# EAGLE design prototype_total_schematic_2355 (EAGLE 8.4.1)
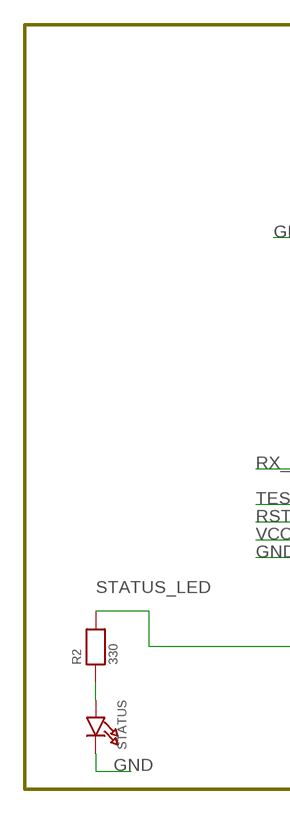
[diagram p0: schematic, sheet 1, part 1 of 2]
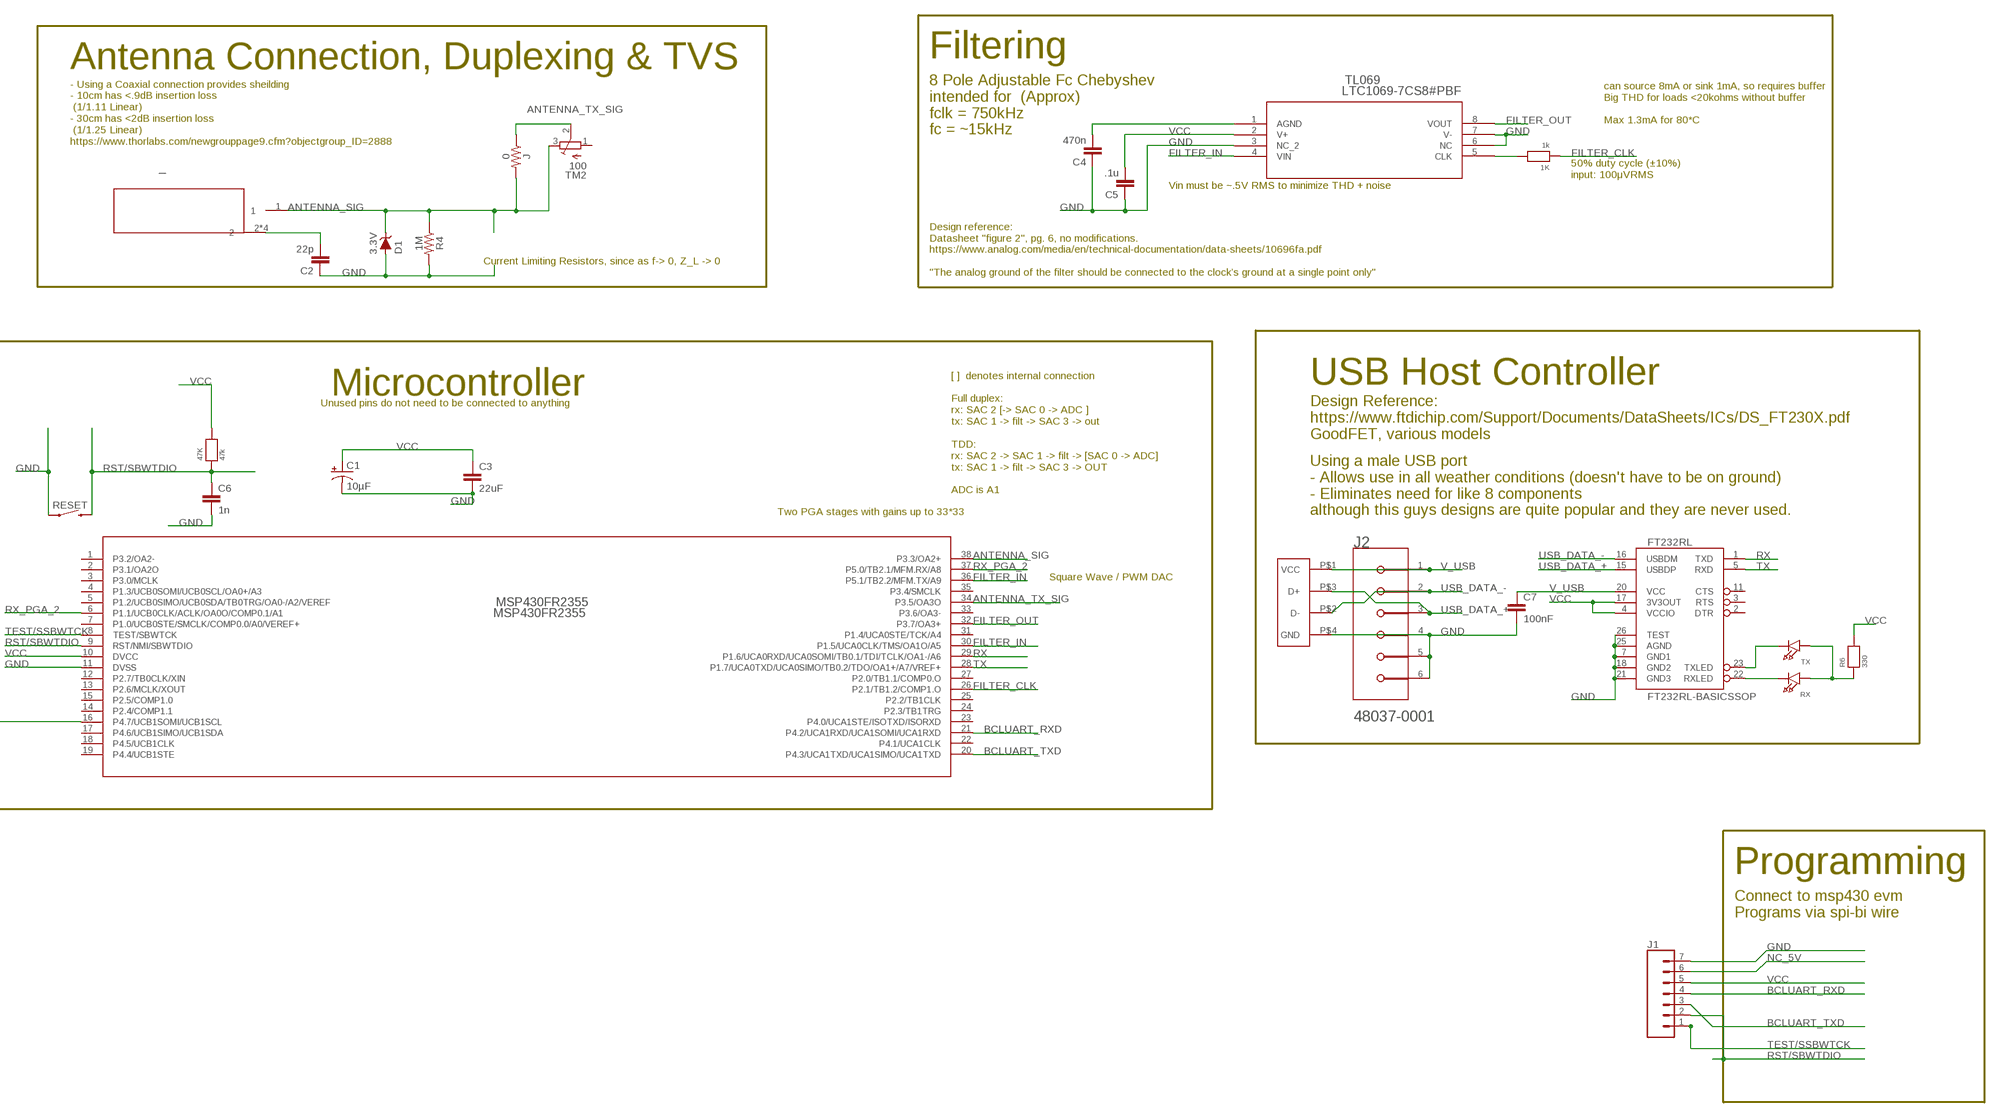
[diagram p1: schematic, sheet 1, part 2 of 2]

## Parts
1K  1k  RESISTOR0805  [0805]
47K  47k  RESISTOR0805  [0805]
_  5-1814400-1  [5-1814400-1]
C1  10µF  10UF-POLAR-EIA6032-25V-10%  [EIA6032-NOM]
C2  22p  22UF-0805-6.3V-20%  [0805]
C3  22uF  22UF-0805-6.3V-20%  [0805]
C4  470n  22UF-0805-6.3V-20%  [0805]
C5  .1u  22UF-0805-6.3V-20%  [0805]
C6  1n  22UF-0805-6.3V-20%  [0805]
C7  100nF  22UF-0805-6.3V-20%  [0805]
D1  3.3V  DIODE-ZENER-MM3Z3V3T1G  [SOD-323]
FT232RL  FT232RL-BASICSSOP  [SSOP28DB]
J  0  2.0KOHM-0603-1/10W-5%  [0603]
J1  CONN_07NO_SILK  [1X07_NO_SILK]
J2  MOLEX_48037-0001MOLEX_48037-0001_0_0  [MOLEX_48037-0001_0]
MSP430FR2355  MSP430FR2355  [DA38]
R2  330  RESISTOR0805  [0805]
R4  1M  2.0KOHM-0603-1/10W-5%  [0603]
R6  330  RESISTOR0805  [0805]
RESET  MOMENTARY-SWITCH-SPST-PTH-6.0MM  [TACTILE_SWITCH_PTH_6.0MM]
RX  LED0805  [CHIPLED_0805]
STATUS  LED0805  [CHIPLED_0805]
TL069  LTC1069-7CS8#PBF  [SO-8_S]
TM2  100  TRIMPOTTC33X  [TC33X]
TX  LED0805  [CHIPLED_0805]
U$1  USB-PCB  [PCB_USB]

## Nets
ANTENNA_SIG: _.1 D1.C J.2 MSP430FR2355.38(P3.3/OA2+) R4.1 TM2.3(E)
ANTENNA_TX_SIG: J.1 MSP430FR2355.34(P3.5/OA3O) TM2.2(S)
BCLUART_RXD: J1.4 MSP430FR2355.21(P4.2/UCA1RXD/UCA1SOMI/UCA1RXD)
BCLUART_TXD: J1.3 MSP430FR2355.20(P4.3/UCA1TXD/UCA1SIMO/UCA1TXD)
FILTER_CLK: 1K.1 MSP430FR2355.26(P2.1/TB1.2/COMP1.O)
FILTER_IN: MSP430FR2355.30(P1.5/UCA0CLK/TMS/OA1O/A5) MSP430FR2355.36(P5.1/TB2.2/MFM.TX/A9) TL069.4(VIN)
FILTER_OUT: MSP430FR2355.32(P3.7/OA3+) TL069.8(VOUT)
GND: C1.C(-) C2.1 C3.2 C4.1 C5.1 C6.2 C7.2 D1.A FT232RL.7(GND1) FT232RL.18(GND2) FT232RL.21(GND3) FT232RL.25(AGND) FT232RL.26(TEST) J1.7 J2.4 J2.5(MNT_1) J2.6(MNT_2) MSP430FR2355.11(DVSS) R4.2 RESET.1 STATUS.C TL069.3(NC_2) TL069.6(NC) TL069.7(V-) U$1.P$4(GND)
N$1: 1K.2 TL069.5(CLK)
N$2: _.2 _.3 _.4 _.5 C2.2
N$3: C4.2 TL069.1(AGND)
N$19: R2.1 STATUS.A
N$20: FT232RL.22(RXLED) RX.C
N$21: FT232RL.23(TXLED) TX.C
N$22: R6.1 RX.A TX.A
NC_5V: J1.6
RST/SBWTDIO: 47K.1 C6.1 J1.2 MSP430FR2355.9(RST/NMI/SBWTDIO) RESET.3
RX: FT232RL.1(TXD) MSP430FR2355.29(P1.6/UCA0RXD/UCA0SOMI/TB0.1/TDI/TCLK/OA1-/A6)
RX_PGA_2: MSP430FR2355.6(P1.1/UCB0CLK/ACLK/OA0O/COMP0.1/A1) MSP430FR2355.37(P5.0/TB2.1/MFM.RX/A8)
STATUS_LED: MSP430FR2355.16(P4.7/UCB1SOMI/UCB1SCL) R2.2
TEST/SSBWTCK: J1.1 MSP430FR2355.8(TEST/SBWTCK)
TX: FT232RL.5(RXD) MSP430FR2355.28(P1.7/UCA0TXD/UCA0SIMO/TB0.2/TDO/OA1+/A7/VREF+)
USB_DATA_+: FT232RL.15(USBDP) J2.3 U$1.P$3(D+)
USB_DATA_-: FT232RL.16(USBDM) J2.2 U$1.P$2(D-)
V_USB: C7.1 FT232RL.20(VCC) J2.1 U$1.P$1(VCC)
VCC: 47K.2 C1.A(+) C3.1 C5.2 FT232RL.4(VCCIO) FT232RL.17(3V3OUT) J1.5 MSP430FR2355.10(DVCC) R6.2 TL069.2(V+)
Unconnected: FT232RL.2(DTR) FT232RL.3(RTS) FT232RL.11(CTS) MSP430FR2355.1(P3.2/OA2-) MSP430FR2355.2(P3.1/OA2O) MSP430FR2355.5(P1.2/UCB0SIMO/UCB0SDA/TB0TRG/OA0-/A2/VEREF) MSP430FR2355.7(P1.0/UCB0STE/SMCLK/COMP0.0/A0/VEREF+) MSP430FR2355.12(P2.7/TB0CLK/XIN) MSP430FR2355.13(P2.6/MCLK/XOUT) MSP430FR2355.14(P2.4/COMP1.1) MSP430FR2355.15(P2.5/COMP1.0) MSP430FR2355.17(P4.6/UCB1SIMO/UCB1SDA) MSP430FR2355.18(P4.5/UCB1CLK) MSP430FR2355.19(P4.4/UCB1STE) MSP430FR2355.22(P4.1/UCA1CLK) MSP430FR2355.23(P4.0/UCA1STE/ISOTXD/ISORXD) MSP430FR2355.24(P2.3/TB1TRG) MSP430FR2355.25(P2.2/TB1CLK) MSP430FR2355.27(P2.0/TB1.1/COMP0.O) MSP430FR2355.31(P1.4/UCA0STE/TCK/A4) MSP430FR2355.35(P3.4/SMCLK) TM2.1(A)

## Notes on the sheet
- Antenna Connection, Duplexing & TVS | Filtering
- can source 8mA or sink 1mA, so requires buffer
  Big THD for loads <20kohms without buffer
  
  Max 1.3mA for 80*C
- 8 Pole Adjustable Fc Chebyshev
  intended for  (Approx)
  fclk = 750kHz 
  fc = ~15kHz
- - Using a Coaxial connection provides sheilding
  - 10cm has <.9dB insertion loss
   (1/1.11 Linear)
  - 30cm has <2dB insertion loss
   (1/1.25 Linear)
  https://www.thorlabs.com/newgrouppage9.cfm?objectgroup_ID=2888
- 50% duty cycle (±10%)
  input: 100μVRMS
- Vin must be ~.5V RMS to minimize THD + noise
- Current Limiting Resistors, since as f-> 0, Z_L -> 0
- Design reference: 
  Datasheet "figure 2", pg. 6, no modifications.
  https://www.analog.com/media/en/technical-documentation/data-sheets/10696fa.pdf
  
  "The analog ground of the filter should be connected to the clock’s ground at a single point only"
- Microcontroller | USB Host Controller
- Unused pins do not need to be connected to anything
- Design Reference:
  https://www.ftdichip.com/Support/Documents/DataSheets/ICs/DS_FT230X.pdf
  GoodFET, various models
- [ ]  denotes internal connection
  
  Full duplex:
  rx: SAC 2 [-> SAC 0 -> ADC ]
  tx: SAC 1 -> filt -> SAC 3 -> out
  
  TDD:
  rx: SAC 2 -> SAC 1 -> filt -> [SAC 0 -> ADC]
  tx: SAC 1 -> filt -> SAC 3 -> OUT 
  
  ADC is A1
- Two PGA stages with gains up to 33*33
- Using a male USB port
  - Allows use in all weather conditions (doesn't have to be on ground)
  - Eliminates need for like 8 components 
  although this guys designs are quite popular and they are never used.
- Square Wave / PWM DAC
- Programming
- Connect to msp430 evm
  Programs via spi-bi wire

## Power pins joined to a net without a drawn wire
P1.3/UCB0SOMI/UCB0SCL/OA0+/A3: MSP430FR2355.4(P1.3/UCB0SOMI/UCB0SCL/OA0+/A3)
P3.0/MCLK: MSP430FR2355.3(P3.0/MCLK)
P3.6/OA3-: MSP430FR2355.33(P3.6/OA3-)

## Library data of the parts
1K 47K R2 R6 = microbuilder:RESISTOR: Resistors 0402 - 0402 Surface Mount Package 22 Ohm 1% 1/16W [Digikey: 311-22.0LRTR-ND] 33 Ohm 5% 1/16W 1.0K 5% 1/16W 1.5K 5% 1/16W 2.0K 1% 1/16W 10.0K 1% 1/16W [Digikey: 311-10.0KLRTR-ND] 10.0K 5% 1/16W [Digikey: RMCF0402JT10K0TR-ND] 12.1K 1% 1/16W [Digikey: 311-22.0LRTR-ND] 100.0K 5% 1/16W 0603 - 0603 Surface Mount Package 0 Ohm 1/10 Watt 1% Resistor 15 Ohm 1/10 Watt 1% Resistor 33 Ohm 1/10 Watt 1% Resistor 49.9 Ohm 1/10 Watt 1% Resistor 100 Ohm 1/10 Watt 1% Resistor 150 Ohm 1/10 Watt 1% Resistor 240 Ohm 1/10 Watt 1% Resistor 390 Ohm 1/10 Watt 1% Resistor 560 Ohm 1/10 Watt 1% Resistor 680 Ohm 1/10 Watt 1% Resistor 750 Ohm 1/10 Watt 1% Resistor 1.0K Ohm 1/10 Watt 1% Resistor 1.5K Ohm 1/10 Watt 1% Resistor 2.0K Ohm 1/10 Watt 1% Resistor 2.2K Ohm 1/10 Watt 1% Resistor 3.3K Ohm 1/10 Watt 1% Resistor 4.7K Ohm 1/10 Watt 1% Resistor 10.0K Ohm 1/10 Watt 1% Resistor 12.0K Ohm 1/10 Watt 1% Resistor 12.1K Ohm 1/10 Watt 1% Resistor 20.0K Ohm 1/10 Watt 1% Resistor 33.0K Ohm 1/10 Watt 1% Resistor 100.0K Ohm 1/10 Watt 1% Resistor 0805 - 0805 Surface Mount Package 0 Ohm 1/8 Watt 1% Resistor 33 Ohm 1/8 Watt 1% Resistor 100 Ohm 1/8 Watt 1% Resistor 150 Ohm 1/8 Watt 1% Resistor 200 Ohm 1/8 Watt 1% Resistor 240 Ohm 1/8 Watt 1% Resistor 330 Ohm 1/8 Watt 1% Resistor 390 Ohm 1/8 Watt 1% Resistor 470 Ohm 1/8 Watt 1% Resistor 1.0K Ohm 1/8 Watt 1% Resistor 1.5K Ohm 1/8 Watt 1% Resistor 2.0K Ohm 1/8 Watt 1% Resistor 4.7K Ohm 1/8 Watt 1% Resistor 5.1K Ohm 1/8 Watt 1% Resistor 5.6K Ohm 1/8 Watt 1% Resistor 10.0K Ohm 1/8 Watt 1% Resistor 22.0K Ohm 1/8 Watt 1% Resistor 33.0K Ohm 1/8 Watt 1% Resistor 100K Ohm 1/8 Watt 1% Resistor 1206 - 1206 Surface Mount Package 2012 - 2010 Surface Mount Package 0.11 Ohm 1/2 Watt 1% Resistor - Digikey: RHM.11UCT-ND
_ = TTE:5-1814400-1; MANUFACTURER_PART_NUMBER: 518144001; VENDOR: TE Connectivity
C1 = SparkFun-Capacitors:10UF-POLAR: 10.0µF polarized capacitors A capacitor is a passive two-terminal electrical component used to store electrical energy temporarily in an electric field.; PROD_ID: CAP-12984
C2 C4-C7 = SparkFun-Capacitors:22UF: 22µF ceramic capacitors A capacitor is a passive two-terminal electrical component used to store electrical energy temporarily in an electric field.; PROD_ID: CAP-08402; VALUE: 22uF
C3 = SparkFun-Capacitors:22UF: 22µF ceramic capacitors A capacitor is a passive two-terminal electrical component used to store electrical energy temporarily in an electric field.; PROD_ID: CAP-08402
D1 = SparkFun-DiscreteSemi:DIODE-ZENER: Zener Diode A Zener diode allows current to flow from its anode to its cathode like a normal semiconductor diode, but it also permits current to flow in the reverse direction when its "Zener voltage" is reached. - WIkipedia; PROD_ID: DIO-11284
FT232RL = SparkFun:FT232RL-BASIC: USB UART This is the simplified version of the FT232RL unit. Only what you need, nothing you don't. Spark Fun Electronics SKU : COM-00650
J R4 = SparkFun-Resistors:2.0KOHM: 2kΩ resistor A resistor is a passive two-terminal electrical component that implements electrical resistance as a circuit element. Resistors act to reduce current flow, and, at the same time, act to lower voltage levels within circuits. - Wikipedia; PROD_ID: RES-08296; VALUE: 2.0k
J1 = SparkFun-Connectors:CONN_07: Multi connection point. Often used as Generic Header-pin footprint for 0.1 inch spaced/style header connections On any of the 0.1 inch spaced packages, you can populate with these: Break Away Headers - Straight <https://www.sparkfun.com/products/116> (PRT-00116) Break Away Male Headers - Right Angle <https://www.sparkfun.com/products/553> (PRT-00553) Female Headers <https://www.sparkfun.com/products/115> (PRT-00115) Break Away Headers - Machine Pin <https://www.sparkfun.com/products/117> (PRT-00117) Break Away Female Headers - Swiss Machine Pin <https://www.sparkfun.com/products/743> (PRT-00743) For SCREWTERMINALS and SPRING TERMINALS visit here: Screw Terimnals on SparkFun.com <https://www.sparkfun.com/search/results?term=Screw+Terminals> (5mm/3.5mm/2.54mm spacing) This device is also useful as a general connection point to wire up your design to another part of your project. Our various solder wires solder well into these plated through hole pads. Hook-Up Wire - Assortment (Stranded, 22 AWG) <https://www.sparkfun.com/products/11375> (PRT-11375) Hook-Up Wire - Assortment (Solid Core, 22 AWG) <https://www.sparkfun.com/products/11367> (PRT-11367) View the entire wire category on our website here <https://www.sparkfun.com/categories/141> Special notes: Molex polarized connector foot print use with SKU : PRT-08231 with associated crimp pins and housings. 1MM SMD Version SKU: PRT-10208 NOTES ON THE VARIANTS LOCK and LOCK_LONGPADS... This footprint was designed to help hold the alignment of a through-hole component (i.e. 6-pin header) while soldering it into place. You may notice that each hole has been shifted either up or down by 0.005 of an inch from it's more standard position (which is a perfectly straight line). This slight alteration caused the pins (the squares in the middle) to touch the edges of the holes. Because they are alternating, it causes a "brace" to hold the component in place. 0.005 has proven to be the perfect amount of "off-center" position when using our standard breakaway headers. Although looks a little odd when you look at the bare footprint, once you have a header in there, the alteration is very hard to notice. Also,if you push a header all the way into place, it is covered up entirely on the bottom side.
J2 = TTE:MOLEX_48037-0001: Universal Serial Bus (USB) Shielded I/O Plug, Type A, Right Angle, Through Hole, 0.76µm Gold (Au) Plating, PCB Thickness 1.20mm-1.60mm, Lead-Free; CENTROID_NOT_SPECIFIED: No; DATASHEET: http://www.molex.com/elqNow/elqRedir.htm?ref=http://www.molex.com/pdm_docs/sd/480370001_sd.pdf; DIGIKEY_DESCRIPTION: CONN PLUG USB 4POS RT ANG PCB; DIGIKEY_PART_NUMBER: WM17117-ND; IMPORTED_FROM: octopart; IS_FEMALE: yes; LEAD_FREE: yes; MF: Molex; MOUSER_PART_NUMBER: 538-48037-0001; MPN: 48037-0001; NUM_PINS: 2; OCTOPART_PART_NUMBER: 6671af1c981eb9b6; PACKAGE: CONN_USB_PTH_18MM8_12MM0; PREFIX: J; ROHS: yes; TEMPERATURE_RANGE_HIGH: +85°C; TEMPERATURE_RANGE_LOW: -20°C
MSP430FR2355 = TTE:MSP430FR2355
RESET = SparkFun-Switches:MOMENTARY-SWITCH-SPST: Momentary Switch (Pushbutton) - SPST Normally-open (NO) SPST momentary switches (buttons, pushbuttons). Variants PTH-12MM - 12mm square, through-hole Momentary Pushbutton Switch - 12mm Square <https://www.sparkfun.com/products/9190> (COM-09190) PTH-6.0MM, PTH-6.0MM-KIT - 6.0mm square, through-hole Mini Pushbutton Switch <https://www.sparkfun.com/products/97> (COM-00097) KIT package intended for soldering kit's - only one side of pads' copper is exposed. PTH-RIGHT-ANGLE-KIT - Right-angle, through-hole Right Angle Tactile Button <https://www.sparkfun.com/products/10791> - Used on SparkFun BigTime Watch Kit <https://www.sparkfun.com/products/11734> SMD-12MM - 12mm square, surface-mount Tactile Button - SMD (12mm) <https://www.sparkfun.com/products/12993> (COM-12993) Used on SparkFun PicoBoard <https://www.sparkfun.com/products/11888> SMD-4.5MM - 4.5mm Square Trackball Switch Used on SparkFun Blackberry Trackballer Breakout <https://www.sparkfun.com/products/13169> SMD-4.6MMX2.8MM - 4.60mm x 2.80mm, surface mount Used on SparkFun SAMD21 Mini Breakout <https://www.sparkfun.com/products/13664> SMD-5.2MM, SMD-5.2-REDUNDANT - 5.2mm square, surface-mount Mini Pushbutton Switch - SMD <https://www.sparkfun.com/products/8720> (COM-08720) Used on Arduino Pro Mini <https://www.sparkfun.com/products/11114> REDUNDANT package connects both switch circuits together SMD-6.0X3.5MM - 6.0 x 3.5mm, surface mount Momentary Reset Switch SMD <https://www.sparkfun.com/products/8229> (COM-08229) SMD-6.2MM-TALL - 6.2mm square, surface mount Tactile Button - SMD (6mm) <https://www.sparkfun.com/products/12992> Used on SparkFun Digital Sandbox <https://www.sparkfun.com/products/12651> SMD-RIGHT-ANGLE - Right-angle, surface mount Used on SparkFun Block for Intel® Edison - Arduino <https://www.sparkfun.com/products/13036>; PROD_ID: SWCH-08441; SF_SKU: COM-00097
RX STATUS TX = microbuilder:LED: LED 0603 - 0603 Surface Mount Package 2mA: Green LED - Low Power (3.9mcd, 2ma, 1.7Vf) - Digikey: 475-2709-2-ND Orange LED - Low Power (9.8mcd, 2ma, 1.8Vf) - Digikey: 475-1194-2-ND Red LED - Low Power (5mcd, 2ma, 1.8Vf) - Digikey: 475-1195-2-ND Yellow LED - Low Power (7mcd, 2ma, 1.8Vf) - Digikey: 475-1196-2-ND 5mA: Blue LED - Low Power (17mcd, 5ma, 2.9Vf) - Digikey: LNJ937W8CRACT-ND 0805 - 0805 Surface Mount Package 2mA: Red LED (8.8mcd, 2mA, 1.8Vf, Clear) - Low Power [Digikey: 475-2510-1-ND] Green LED (5mcd, 2mA, 1.8Vf, Clear) - Low Power [Digikey: 475-2730-1-ND] Yellow LED (11.3mcd, 2mA, 1.8Vf, Clear) - Low Power [Digikey: 475-2555-1-ND] 20mA: Red LED (104mcd, 20mA, Diffused) - LS R976 [Digikey: 475-1278-6-ND] Red LED (12mcd, 20mA, 2.0Vf, Clear) - APT2012EC [Digikey: 754-1128-1-ND] Green LED (15mcd, 20mA, 2.2Vf, Clear) - APT2012GC [Digikey: 754-1131-1-ND] Orange LED (160mcd, 20mA, 2.1Vf, Clear) - APT2012SECK [Digikey: 754-1130-1-ND] 1206 - 1206 Surface Mount Package Green LED (26mcd, 20mA, Diffused) - LG N971 [Digikey: 475-1407-6-ND] Red LED (15mcd, 20mA, Diffused) - LH N974 [Digikey: 475-1416-6-ND]
TL069 = TTE:LTC1069-7CS8#PBF; DESCRIPTION: LTC1069-7 - Linear Phase 8th Order Lowpass Filter; DIGI-KEY_PART_NUMBER: LTC1069-7CS8#PBF-ND; DIGI-KEY_PURCHASE_URL: https://www.digikey.com/product-detail/en/linear-technology-analog-devices/LTC1069-7CS8-PBF/LTC1069-7CS8-PBF-ND/889060?utm_source=snapeda&utm_medium=aggregator&utm_campaign=symbol; MF: Linear Technology; MP: LTC1069-7CS8#PBF; PACKAGE: SOIC-8 Linear Technology
TM2 = adafruit:TRIMPOT: SMT trimmer potentiometer part number TC33X http://www.ladyada.net/library/eagle
U$1 = TTE:USB-PCB

## Board
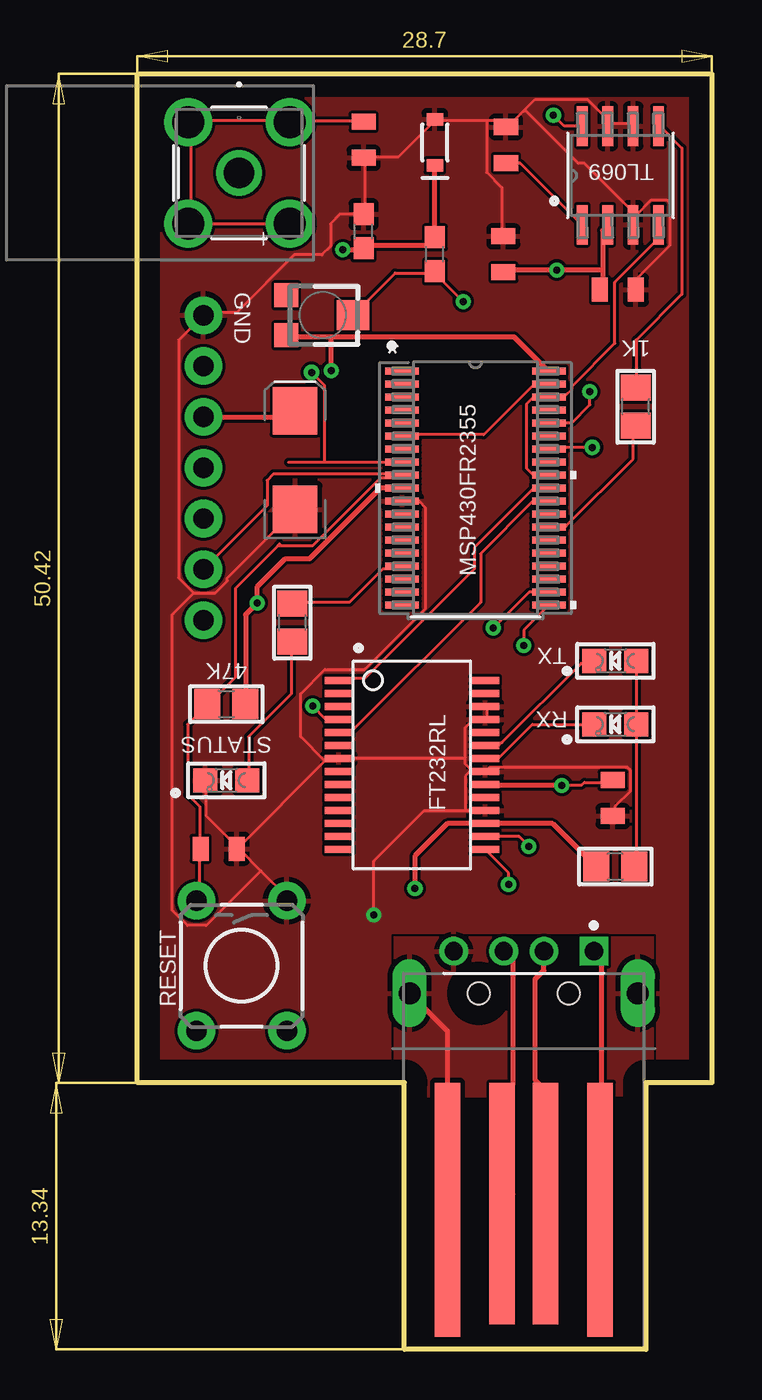
[diagram p2: board, top side]
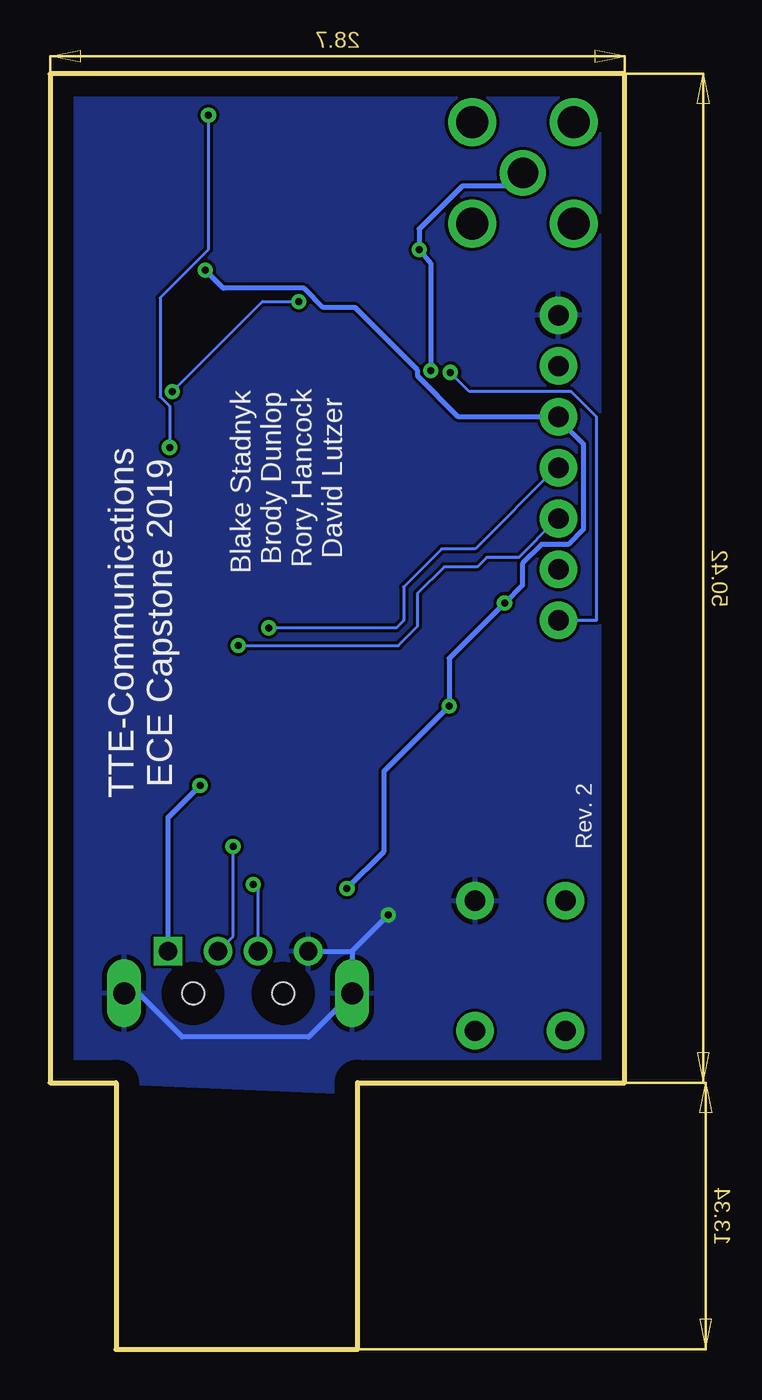
[diagram p3: board, bottom side, seen from below]

Size 28.7 x 63.75 mm. Coordinates in mm from the lower left corner, seen from the top.
Outline: 0,63.75 28.7,63.75 28.7,13.34 25.4,13.34 25.4,0 13.34,0 13.34,13.34 0,13.34 0,63.75
Copper layers (1*16): Top 0.035mm / dielectric 1.5mm / Bottom 0.035mm
Design rules "default": minimum track width 6mil, minimum drill 0.35mm, track to track 6mil, track to pad 6mil, pad to pad 6mil, via to via 6mil, smd to smd 6mil, copper to edge 40mil, drill to drill 6mil, minimum pad ring 10mil, minimum via ring 8mil, stop-mask expansion 4mil, vias tented up to drill 0mil, thermal gap 10mil

### Footprints (pad centres in the part's own frame; a part is rotated, then mirrored left to right if it is on the bottom)
0805 = smd 1.3 x 1.5: 1 -0.95,0; 2 0.95,0
5-1814400-1 = drill 1.524 pad 2.032: 1 0,0 | drill 1.6 pad 2.083: 2 -2.54,2.54; 3 -2.54,-2.54; 4 2.54,-2.54; 5 2.54,2.54
EIA6032-NOM = smd 2.37 x 2.23: A 2.47,0; C -2.47,0
0805' = smd 0.8 x 1.2: 1 -0.9,0; 2 0.9,0
SOD-323 = smd 0.63 x 0.83: A 1.15,0; C -1.15,0
SSOP28DB = smd 0.348 x 1.397: 1 -4.225,-3.656; 2 -3.575,-3.656; 3 -2.925,-3.656; 4 -2.275,-3.656; 5 -1.625,-3.656; 6 -0.975,-3.656; 7 -0.325,-3.656; 8 0.325,-3.656; 9 0.975,-3.656; 10 1.625,-3.656; 11 2.275,-3.656; 12 2.925,-3.656; 13 3.575,-3.656; 14 4.225,-3.656; 15 4.225,3.656; 16 3.575,3.656; 17 2.925,3.656; 18 2.275,3.656; 19 1.625,3.656; 20 0.975,3.656; 21 0.325,3.656; 22 -0.325,3.656; 23 -0.975,3.656; 24 -1.625,3.656; 25 -2.275,3.656; 26 -2.925,3.656; 27 -3.575,3.656; 28 -4.225,3.656
0603 = smd 1.1 x 1: 1 -0.85,0; 2 0.85,0
1X07_NO_SILK = drill 1.016 pad 1.88: 1 0,0; 2 2.54,0; 3 5.08,0; 4 7.62,0; 5 10.16,0; 6 12.7,0; 7 15.24,0
MOLEX_48037-0001_0 = drill 0.92 pad 1.42 square: 1 3.5,10.5 | drill 0.92 pad 1.42: 2 1,10.5; 3 -1,10.5; 4 -3.5,10.5 | drill 1.1 pad 1.7 long: 5 -5.7,8.4; 6 5.7,8.4 | hole 1.1: -2.25,8.4; 2.25,8.4
DA38 = smd 1.676 x 0.356: 1 -3.67,5.85; 2 -3.67,5.2; 3 -3.67,4.55; 4 -3.67,3.9; 5 -3.67,3.25; 6 -3.67,2.6; 7 -3.67,1.95; 8 -3.67,1.3; 9 -3.67,0.65; 10 -3.67,0; 11 -3.67,-0.65; 12 -3.67,-1.3; 13 -3.67,-1.95; 14 -3.67,-2.6; 15 -3.67,-3.25; 16 -3.67,-3.9; 17 -3.67,-4.55; 18 -3.67,-5.2; 19 -3.67,-5.85; 20 3.67,-5.85; 21 3.67,-5.2; 22 3.67,-4.55; 23 3.67,-3.9; 24 3.67,-3.25; 25 3.67,-2.6; 26 3.67,-1.95; 27 3.67,-1.3; 28 3.67,-0.65; 29 3.67,0; 30 3.67,0.65; 31 3.67,1.3; 32 3.67,1.95; 33 3.67,2.6; 34 3.67,3.25; 35 3.67,3.9; 36 3.67,4.55; 37 3.67,5.2; 38 3.67,5.85
TACTILE_SWITCH_PTH_6.0MM = drill 1.016 pad 1.88: 1 -3.251,2.261; 2 3.251,2.261; 3 -3.251,-2.261; 4 3.251,-2.261
CHIPLED_0805 = smd 1.2 x 1.2: A 0,-1.05; C 0,1.05
SO-8_S = smd 1.981 x 0.533: 1 -2.464,1.905; 2 -2.464,0.635; 3 -2.464,-0.635; 4 -2.464,-1.905; 5 2.464,-1.905; 6 2.464,-0.635; 7 2.464,0.635; 8 2.464,1.905
TC33X = smd 1.2 x 1.2: 1 -1,-1.825; 3 1,-1.825 | smd 1.5 x 1.6: 2 0,1.5
PCB_USB = smd 1.27 x 12.7: P$1 -3.81,6.35; P$4 3.81,6.35 | smd 1.27 x 12.065: P$2 -1.079,6.032; P$3 1.079,6.032

### Placement (x,y rotation side)
1K  24.89,47.12 90 top
47K  4.45,32.26 0 top
_  5.08,58.8 90 top
C1  7.87,44.45 90 top
C2  22p  [0805']  11.3,60.45 90 top
C3  22uF  [0805']  24,52.96 0 top
C4  470n  [0805']  18.41,60.2 270 top
C5  .1u  [0805']  18.29,54.74 270 top
C6  1n  [0805']  4.06,25.02 0 top
C7  100nF  [0805']  23.75,27.56 270 top
D1  14.86,60.33 90 top
FT232RL  13.72,29.21 270 top
J  14.86,54.74 90 top
J1  3.3,36.45 90 top
J2  19.3,9.4 0 top
MSP430FR2355  16.89,43.05 0 top
R2  7.75,36.32 90 top
R4  11.3,55.88 90 top
R6  23.88,24.13 180 top
RESET  5.21,19.18 270 top
RX  23.88,31.24 90 top
STATUS  4.45,28.45 90 top
TL069  24.13,58.67 90 top
TM2  9.27,51.69 270 top
TX  23.88,34.42 90 top
U$1  19.3,13.34 180 top

### Tracks (layer width: path | path; a pad name or v marks a point on that pad's centre or on a via)
ANTENNA_SIG  (via drill 0.35)
  Top 0.152: 7.54,50.6 TM2.3 | 20.5,48.92 MSP430FR2355.38 | 14.55,55.17 14.86,55.47 J.2 | 11.35,55.17 R4.1 11.2,55.02
  Top 0.254: 9.68,50.6 18.82,50.6 20.5,48.92 | 9.68,50.6 7.54,50.6 | J.2 D1.C | 14.55,55.17 11.35,55.17 | 11.2,55.02 10.92,55.02 10.87,54.97 v10.26,54.97 | v9.68,48.92 9.68,50.6
  Bottom 0.254: v9.68,48.92 9.68,54.25 v10.26,54.97 10.26,55.99 8.11,58.15 5.73,58.15 _.1
ANTENNA_TX_SIG  (via drill 0.35)
  Top 0.152: 14.86,53.8 12.88,53.8 10.9,51.82 TM2.2 | 14.86,53.8 v16.28,52.38 | MSP430FR2355.34 20.65,46.33 21.72,46.33 22.6,47.21 v22.6,47.87 | 14.86,53.8 J.1
  Bottom 0.152: v22.6,47.87 18.1,52.38 v16.28,52.38
BCLUART_RXD  (via drill 0.35)
  Top 0.152: MSP430FR2355.21 19.56,37.85 v17.78,36.07
  Bottom 0.152: J1.4 3.43,44.04 7.47,40 9.14,40 11.04,38.11 11.04,36.44 11.41,36.07 v17.78,36.07
BCLUART_TXD  (via drill 0.35)
  Top 0.152: MSP430FR2355.20 19.3,35.95 v19.3,35.18
  Bottom 0.152: J1.3 3.43,41.45 5.3,39.59 6.9,39.59 7.37,39.12 9.02,39.12 10.35,37.78 10.35,36.13 11.3,35.18 v19.3,35.18
FILTER_CLK
  Top 0.152: 1K.1 24.77,46.03 24.77,44.5 21.41,41.15 20.65,41.15 MSP430FR2355.26
FILTER_IN
  Top 0.152: MSP430FR2355.30 20.5,43.74 19.74,43.74 19.43,44.04 19.43,47.24 19.74,47.55 20.5,47.55 MSP430FR2355.36 20.65,47.7 21.41,47.7 21.72,48.01 21.72,48.16 23.85,50.29 23.85,53.34 25.98,55.47 25.98,56.08 TL069.4
FILTER_OUT  (via drill 0.35)
  Top 0.152: MSP430FR2355.32 20.65,45.11 20.83,45.11 20.85,45.08 v22.73,45.08 | TL069.8 21.33,61.14 v20.79,61.68
  Bottom 0.152: v20.79,61.68 20.79,54.98 23.21,52.56 23.21,47.62 22.73,47.15 v22.73,45.08
GND  (via drill 0.35)
  Top 0.152: 2.82,37.8 3.89,37.8 4.5,38.41 4.5,38.56 7.85,41.91 C1.C | 2.82,37.8 2.06,38.56 2.06,50.44 J1.7 3.43,51.82 4.95,51.82 7.85,54.71 9.22,54.71 9.65,55.14 9.65,56.26 10.12,56.73 R4.2 11.35,56.84 11.35,59.44 C2.1 11.35,59.59 13.03,59.59 14.86,61.42 | 24.92,56.69 24.77,56.54 TL069.3 24.92,56.69 | 24.92,56.69 25.68,57.45 26.44,57.45 26.59,57.3 26.59,55.17 24.92,53.49 24.92,53.04 C3.2 | TL069.6 24.77,61.27 23.55,61.27 TL069.7 23.39,61.27 23.39,61.57 22.48,62.48 19.89,62.48 19.28,61.87 | 17.45,61.42 18.06,61.42 18.36,61.11 C4.1 18.52,61.11 19.28,61.87 | 17.45,61.42 14.86,61.42 | 17.45,61.42 17.45,58.83 18.21,58.06 18.21,55.78 C5.1 | 14.86,61.42 D1.A | 24.92,56.69 22.33,59.28 22.02,59.28 19.43,61.87 19.28,61.87 | FT232RL.26 17.45,32 17.45,31.55 FT232RL.25 17.3,31.39 16.69,31.39 16.38,31.09 16.38,29.57 | C7.2 23.85,26.67 23.85,27.13 24.61,27.89 24.61,28.96 24.46,29.11 17.6,29.11 17.45,28.96 FT232RL.21 | 16.38,29.57 16.38,29.26 16.69,28.96 | 16.69,28.96 17.3,28.96 FT232RL.21 | 6.17,23.93 7.54,22.56 RESET.1 | 6.17,23.93 5.1,24.99 C6.2 | STATUS.C 3.43,28.35 3.43,26.67 4.95,25.15 C6.2 | 9.37,29.41 9.98,29.41 FT232RL.7 | 9.37,29.41 5.1,25.15 C6.2 | 9.37,29.41 8.15,30.63 8.15,32.77 9.37,33.98 11.35,33.98 14.4,37.03 14.4,42.06 14.1,42.37 13.34,42.37 MSP430FR2355.11 | 9.37,29.41 FT232RL.7 | 16.38,29.57 10.13,29.57 FT232RL.7 | 15.47,7.01 U$1.P$4 | 2.82,37.8 1.75,36.73 1.75,21.95 2.52,21.18 3.43,21.18 6.17,23.93 | 16.38,26.93 FT232RL.18 | 16.38,26.93 16.38,28.65 16.69,28.96 | 16.69,28.96 FT232RL.21 | v11.81,21.72 11.81,24.41 14.34,26.93 16.38,26.93
  Top 0.254: U$1.P$4 15.49,15.91 J2.5
  Bottom 0.152: 7.54,22.4 RESET.1 | 12.06,21.46 v11.81,21.72 | 13.63,19.9 13.6,19.92
  Bottom 0.254: 12.06,21.46 13.6,19.92 J2.5 15.78,15.62 22.1,15.62 24.27,17.8 J2.6 | J2.4 13.63,19.9
  pour Bottom: 29.59,64.39 -1.02,63.88 -0.25,12.19 29.46,13.46
  pour Top: -0.89,64.01 29.46,64.14 29.97,12.7 -0.38,12.57
N$1
  Top 0.152: 1K.2 24.92,48.16 24.92,50.44 27.2,52.73 27.2,60.05 26.14,61.11 TL069.5
N$2
  Top 0.152: _.3 7.54,56.24 2.67,56.24 _.2 2.67,56.39 2.67,61.27 _.5 2.67,61.42 7.54,61.42 _.4 7.7,61.42 11.2,61.42 C2.2
N$3
  Top 0.152: C4.2 18.52,59.28 19.13,59.28 22.17,56.24 TL069.1
N$19
  Top 0.152: STATUS.A 5.56,28.5 5.56,30.63 7.7,32.77 7.7,35.36 R2.1
N$20
  Top 0.152: RX.C 19.74,31.24 18.06,29.57 17.45,29.57 FT232RL.22
N$21
  Top 0.152: TX.C 22.78,34.29 22.17,34.29 18.21,30.33 18.16,30.33 18.02,30.18 FT232RL.23
N$22
  Top 0.152: RX.A 24.92,34.29 TX.A | RX.A 24.92,24.23 R6.1 | RX.A
RST/SBWTDIO
  Top 0.152: RESET.3 2.97,22.56 3.12,22.71 3.12,24.99 C6.1 3.12,25.15 3.12,27.13 2.52,27.74 2.52,31.24 3.43,32.16 47K.1 | 3.43,32.31 47K.1 | 7.04,40.18 7.11,40.18 | 7.11,40.18 8.76,40.18 12.17,43.59 13.1,43.59 MSP430FR2355.9 13.15,43.75 6.79,43.75 6.48,43.43 6.48,42.16 J1.2 | 47K.1 3.62,32.32 4.89,33.59 4.89,38.04 7.11,40.26 7.11,40.18
RX
  Top 0.152: FT232RL.1 10.13,33.53 11.35,33.53 16.84,39.01 16.84,40.08 19.74,42.98 20.5,42.98 MSP430FR2355.29
RX_PGA_2
  Top 0.152: MSP430FR2355.6 13.34,45.72 17.3,45.72 19.74,48.16 20.5,48.16 MSP430FR2355.37
STATUS_LED
  Top 0.152: R2.2 7.85,37.34 10.59,37.34 12.27,39.01 13.18,39.01 MSP430FR2355.16
TEST/SSBWTCK  (via drill 0.35)
  Top 0.152: 7.54,44.35 9.33,44.35 | 9.33,44.35 13.18,44.35 MSP430FR2355.8 | 9.33,44.35 9.33,48.2 v8.7,48.83
  Bottom 0.152: v8.7,48.83 7.75,47.88 2.67,47.88 1.4,46.61 1.4,36.45 J1.1
TX
  Top 0.152: FT232RL.5 10.13,30.94 10.74,30.94 17.15,37.34 17.15,39.78 19.74,42.37 20.5,42.37 MSP430FR2355.28
USB_DATA_+  (via drill 0.35)
  Top 0.152: 18.82,7.77 18.36,7.32 U$1.P$3 18.22,12.7 | v18.54,23.24 18.54,23.82 FT232RL.15
  Top 0.254: 18.22,12.7 18.75,13.22 18.75,19.46 J2.3
  Bottom 0.152: J2.3 18.3,23 v18.54,23.24
USB_DATA_-  (via drill 0.35)
  Top 0.152: 19.89,7.77 20.34,7.32 U$1.P$2 | v19.56,25.15 19.07,25.64 FT232RL.16
  Top 0.254: J2.2 20.3,18.94 19.86,18.5 19.86,13.48 20.38,12.95 U$1.P$2
  Bottom 0.152: J2.2 19.56,20.64 v19.56,25.15
V_USB  (via drill 0.35)
  Top 0.152: 16.69,28.19 17.3,28.19 FT232RL.20 17.41,28.19 | C7.1 23.7,28.35 22.33,28.35 22.17,28.19 v21.21,28.19 | U$1.P$1 23.24,7.01 23.24,12.32 23.2,12.36
  Top 0.254: v21.21,28.19 17.41,28.19 | J2.1 23.2,19.51 23.2,12.36
  Bottom 0.254: J2.1 22.8,26.6 v21.21,28.19
VCC  (via drill 0.35)
  Top 0.152: 5.41,32.31 47K.2 | 23.24,55.93 23.39,56.08 TL069.2 | 23.24,53.04 C3.1 | 18.36,53.95 C5.2 18.21,53.95 | v8.76,32.16 9.37,31.55 9.98,31.55 FT232RL.4 | 22.78,24.23 22.82,24.2 R6.2 | 7.85,46.79 C1.A | 3.43,46.63 J1.5
  Top 0.254: 5.41,32.31 5.41,36.73 v5.99,37.31 5.99,38.12 7.39,39.53 8.61,39.53 9.12,40.04 | 23.24,55.93 23.24,53.95 | 23.24,53.95 23.24,53.04 | 23.24,53.95 v20.95,53.95 18.36,53.95 | 22.82,24.2 20.74,26.29 FT232RL.17 15.49,26.29 13.87,24.66 v13.87,23.04 | MSP430FR2355.10 12.14,43.05 9.12,40.04 | 9.12,40.04 | J1.5 7.67,46.61 7.85,46.79
  Bottom 0.254: v13.87,23.04 12.01,24.89 12.01,28.9 v8.76,32.16 8.76,34.54 v5.99,37.31 5.11,38.2 5.11,39.27 4.15,40.23 2.82,40.23 2.06,41 2.06,45.26 3.28,46.48 J1.5 8.3,46.61 10.34,48.65 10.34,48.94 13.46,52.07 15.05,52.07 16.01,53.03 20.04,53.03 v20.95,53.95

### Text on the board
tNames: GND
bNames: Blake Stadnyk / Brody Dunlop / Rory Hancock / David Lutzer | TTE-Communications / ECE Capstone 2019 | Rev. 2